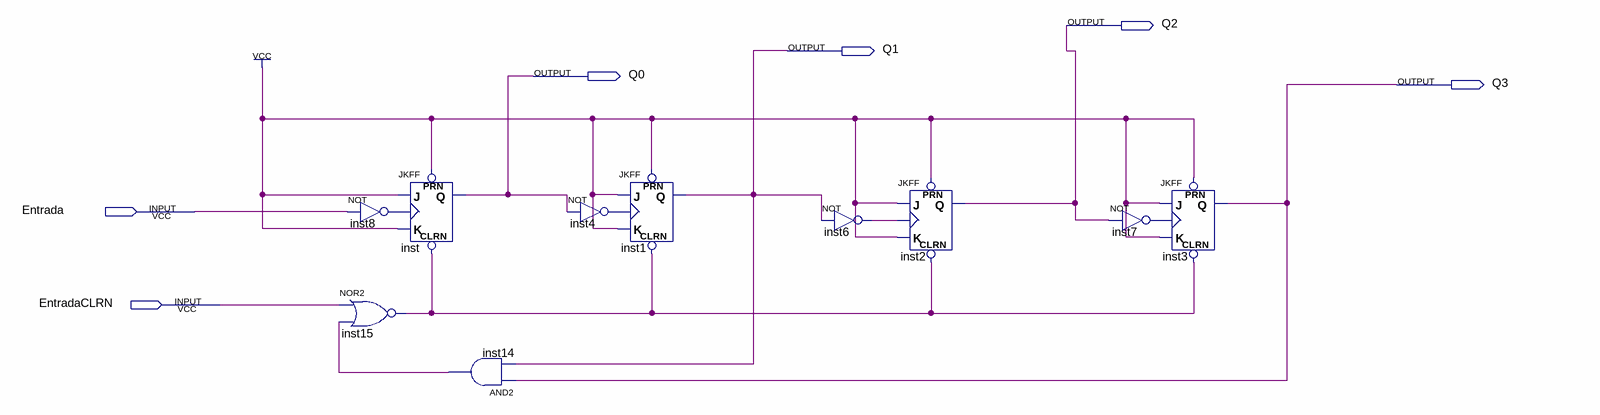
[diagram p0: schematic sheet]
// Quartus schematic Mod10Modificable.bdf as structural Verilog: 10 symbols, 6 pins
module Mod10Modificable (
  input  Entrada,
  input  EntradaCLRN,
  output Q2,
  output Q1,
  output Q0,
  output Q3
);

  wire inst4_out, inst6_out, inst7_out, inst8_out, inst14_out, inst15_out;

  not inst8 (inst8_out, Entrada);
  nor inst15 (inst15_out, EntradaCLRN, inst14_out);
  JKFF inst (.PRN(1'b1), .CLRN(inst15_out), .K(1'b1), .J(1'b1), .CLK(inst8_out), .Q(Q0));
  and inst14 (inst14_out, Q3, Q1);
  not inst4 (inst4_out, Q0);
  JKFF inst1 (.PRN(1'b1), .CLRN(inst15_out), .K(1'b1), .J(1'b1), .CLK(inst4_out), .Q(Q1));
  not inst6 (inst6_out, Q1);
  JKFF inst2 (.PRN(1'b1), .CLRN(inst15_out), .K(1'b1), .J(1'b1), .CLK(inst6_out), .Q(Q2));
  not inst7 (inst7_out, Q2);
  JKFF inst3 (.PRN(1'b1), .CLRN(inst15_out), .K(1'b1), .J(1'b1), .CLK(inst7_out), .Q(Q3));
endmodule
